# EAGLE design princessPhone (EAGLE 7.3.0)

## Sheet 1 of 4
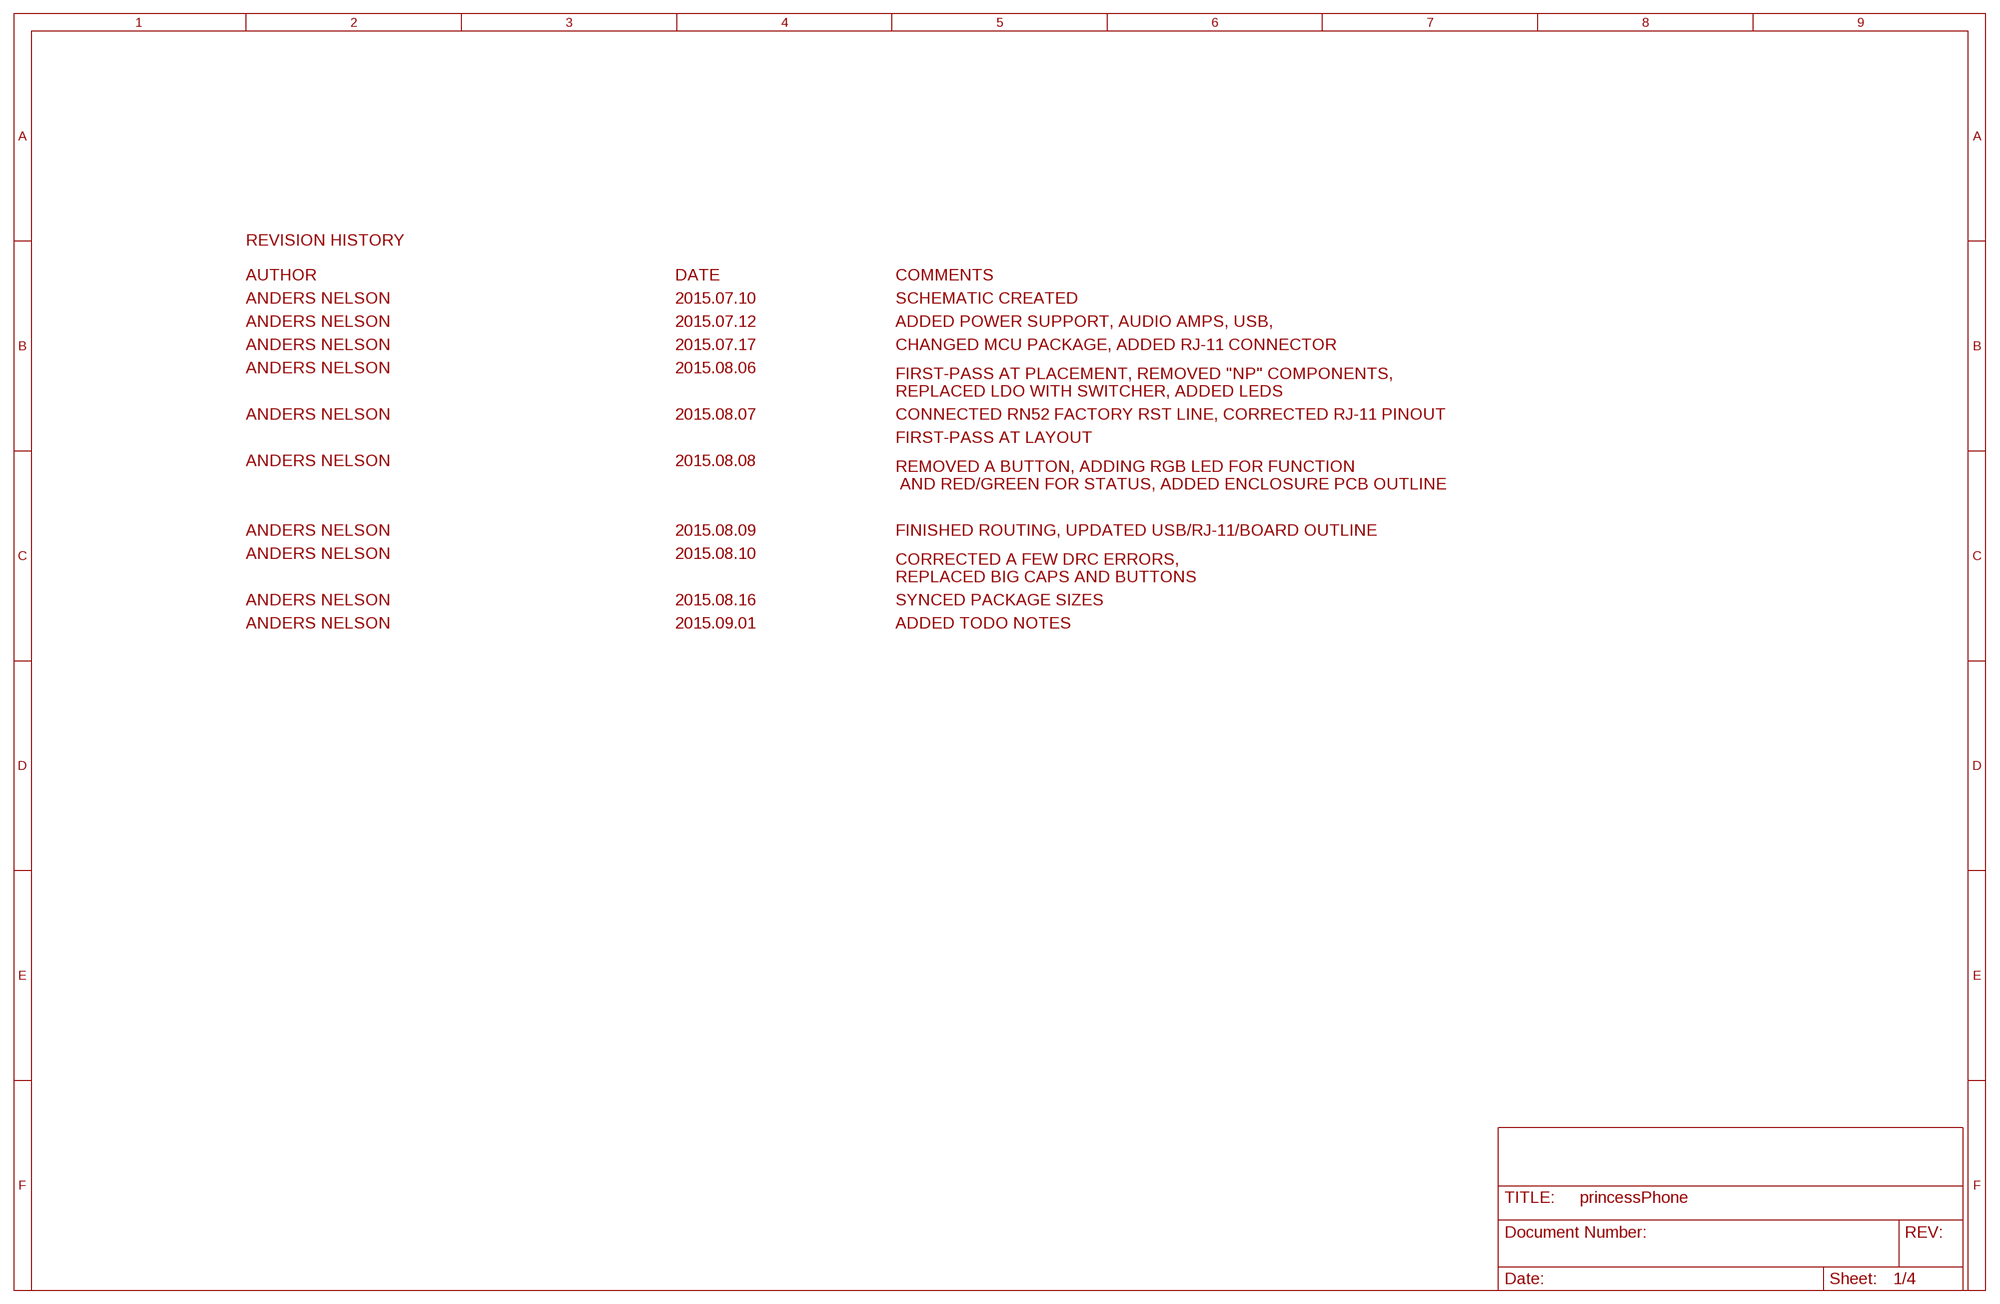
[diagram p0: schematic, sheet 1]

### Notes on the sheet
- REVISION HISTORY
- AUTHOR | DATE | COMMENTS
- ANDERS NELSON | 2015.07.10 | SCHEMATIC CREATED
- ANDERS NELSON | 2015.07.12 | ADDED POWER SUPPORT, AUDIO AMPS, USB,
- ANDERS NELSON | 2015.07.17 | CHANGED MCU PACKAGE, ADDED RJ-11 CONNECTOR
- ANDERS NELSON | 2015.08.06
- FIRST-PASS AT PLACEMENT, REMOVED "NP" COMPONENTS,
  REPLACED LDO WITH SWITCHER, ADDED LEDS
- ANDERS NELSON | 2015.08.07 | CONNECTED RN52 FACTORY RST LINE, CORRECTED RJ-11 PINOUT
- FIRST-PASS AT LAYOUT
- ANDERS NELSON | 2015.08.08
- REMOVED A BUTTON, ADDING RGB LED FOR FUNCTION
   AND RED/GREEN FOR STATUS, ADDED ENCLOSURE PCB OUTLINE
- ANDERS NELSON | 2015.08.09 | FINISHED ROUTING, UPDATED USB/RJ-11/BOARD OUTLINE
- ANDERS NELSON | 2015.08.10
- CORRECTED A FEW DRC ERRORS,
  REPLACED BIG CAPS AND BUTTONS
- ANDERS NELSON | 2015.08.16 | SYNCED PACKAGE SIZES
- ANDERS NELSON | 2015.09.01 | ADDED TODO NOTES

## Sheet 2 of 4
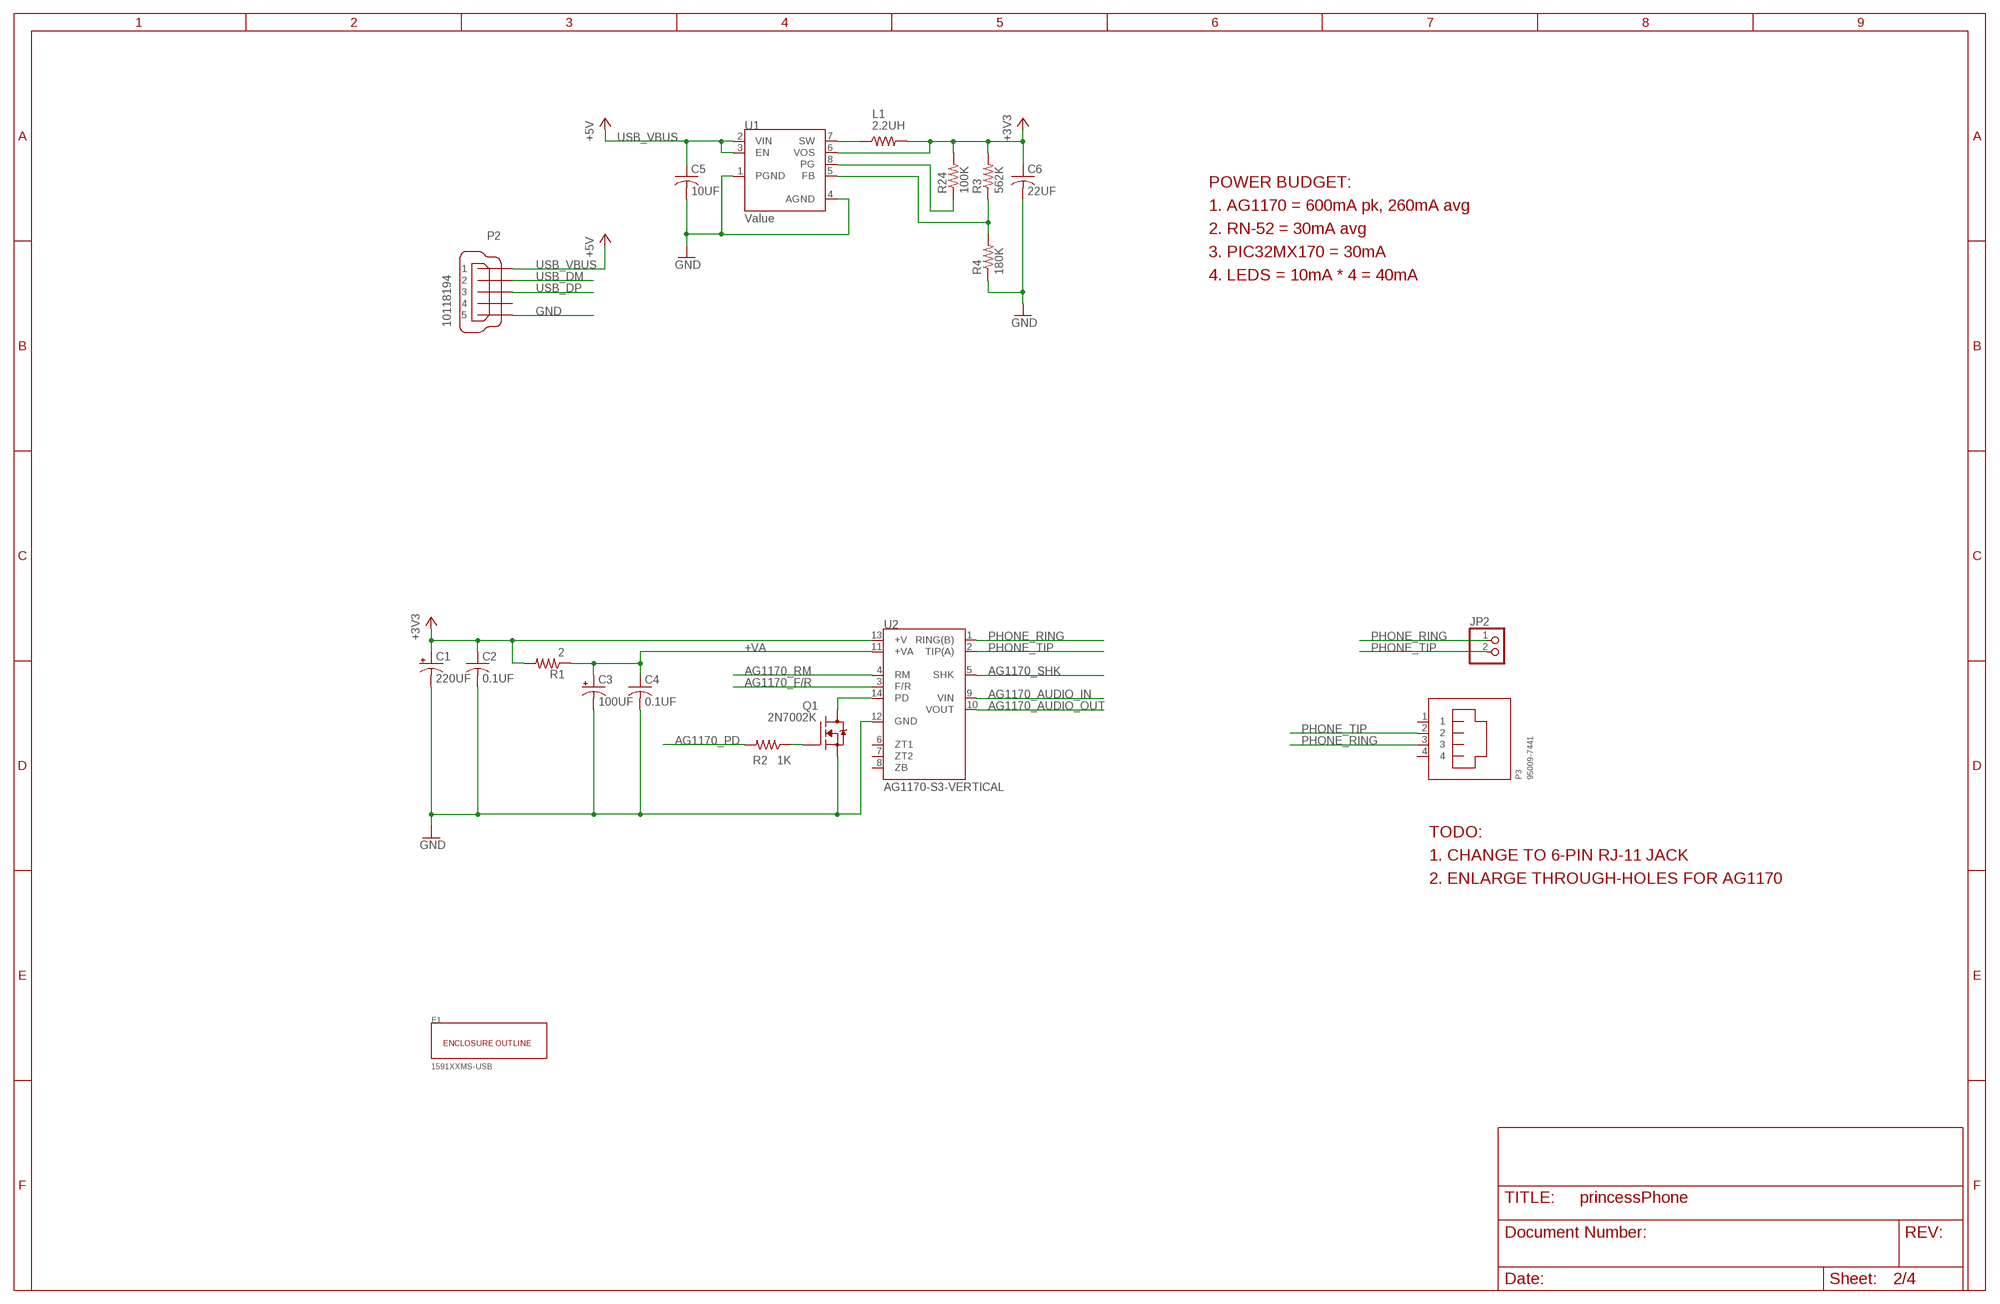
[diagram p1: schematic, sheet 2]

### Parts
C1  220UF  CPOL-USE2.5-7  [E2,5-7]
C2  0.1UF  C-USC0603  [C0603]
C3  100UF  CPOL-USE2.5-7  [E2,5-7]
C4  0.1UF  C-USC0603  [C0603]
C5  10UF  C-USC0603  [C0603]
C6  22UF  C-USC1206  [C1206]
E1  1591XXMS-USB  [1591XXMSBK-USB]
JP2  PINHD-1X2  [1X02]
L1  2.2UH  R-US_R0805  [R0805]
P2  10118194  [10118194]
P3  95009-7441  [95009-7441]
Q1  2N7002K  [SOT23]
R1  2  R-US_R0603  [R0603]
R2  1K  R-US_R0603  [R0603]
R3  562K  R-US_R0603  [R0603]
R4  180K  R-US_R0603  [R0603]
R24  100K  R-US_R0603  [R0603]
U1  Value  TPS62160DGKR  [DGK0008A_N]
U2  AG1170-S3-VERTICAL  [AG1170X-S]

### Nets
+3V3: C1.+ C2.1 C6.1 L1.2 R1.2 R3.2 R24.2 U1.6(VOS) U2.13(+V) ; also sheet 3,4
+VA: C3.+ C4.1 R1.1 U2.11(+VA)
AG1170_AUDIO_IN: U2.9(VIN) ; also sheet 4
AG1170_AUDIO_OUT: U2.10(VOUT) ; also sheet 4
AG1170_F/R: U2.3(F/R) ; also sheet 3
AG1170_PD: R2.2 ; also sheet 3
AG1170_RM: U2.4(RM) ; also sheet 3
AG1170_SHK: U2.5(SHK) ; also sheet 3
GND: C1.- C2.2 C3.- C4.2 C5.2 C6.2 P2.5 Q1.2(S) R4.1 U1.1(PGND) U1.4(AGND) U2.12(GND) ; also sheet 3,4
N$2: Q1.1(G) R2.1
N$3: Q1.3(D) U2.14(PD)
N$5: L1.1 U1.7(SW)
N$6: R24.1 U1.8(PG)
N$8: R3.1 R4.2 U1.5(FB)
PHONE_RING: JP2.1 P3.3 U2.1(RING(B))
PHONE_TIP: JP2.2 P3.2 U2.2(TIP(A))
USB_DM: P2.2 ; also sheet 4
USB_DP: P2.3 ; also sheet 4
USB_VBUS: C5.1 P2.1 U1.2(VIN) U1.3(EN) ; supply symbol labelled +5V ; also sheet 4
Unconnected: P2.4 P3.1 P3.4 U2.6(ZT1) U2.7(ZT2) U2.8(ZB)

### Notes on the sheet
- POWER BUDGET:
- 1. AG1170 = 600mA pk, 260mA avg
- 2. RN-52 = 30mA avg
- 3. PIC32MX170 = 30mA
- 4. LEDS = 10mA * 4 = 40mA
- TODO:
- 1. CHANGE TO 6-PIN RJ-11 JACK
- 2. ENLARGE THROUGH-HOLES FOR AG1170

## Sheet 3 of 4
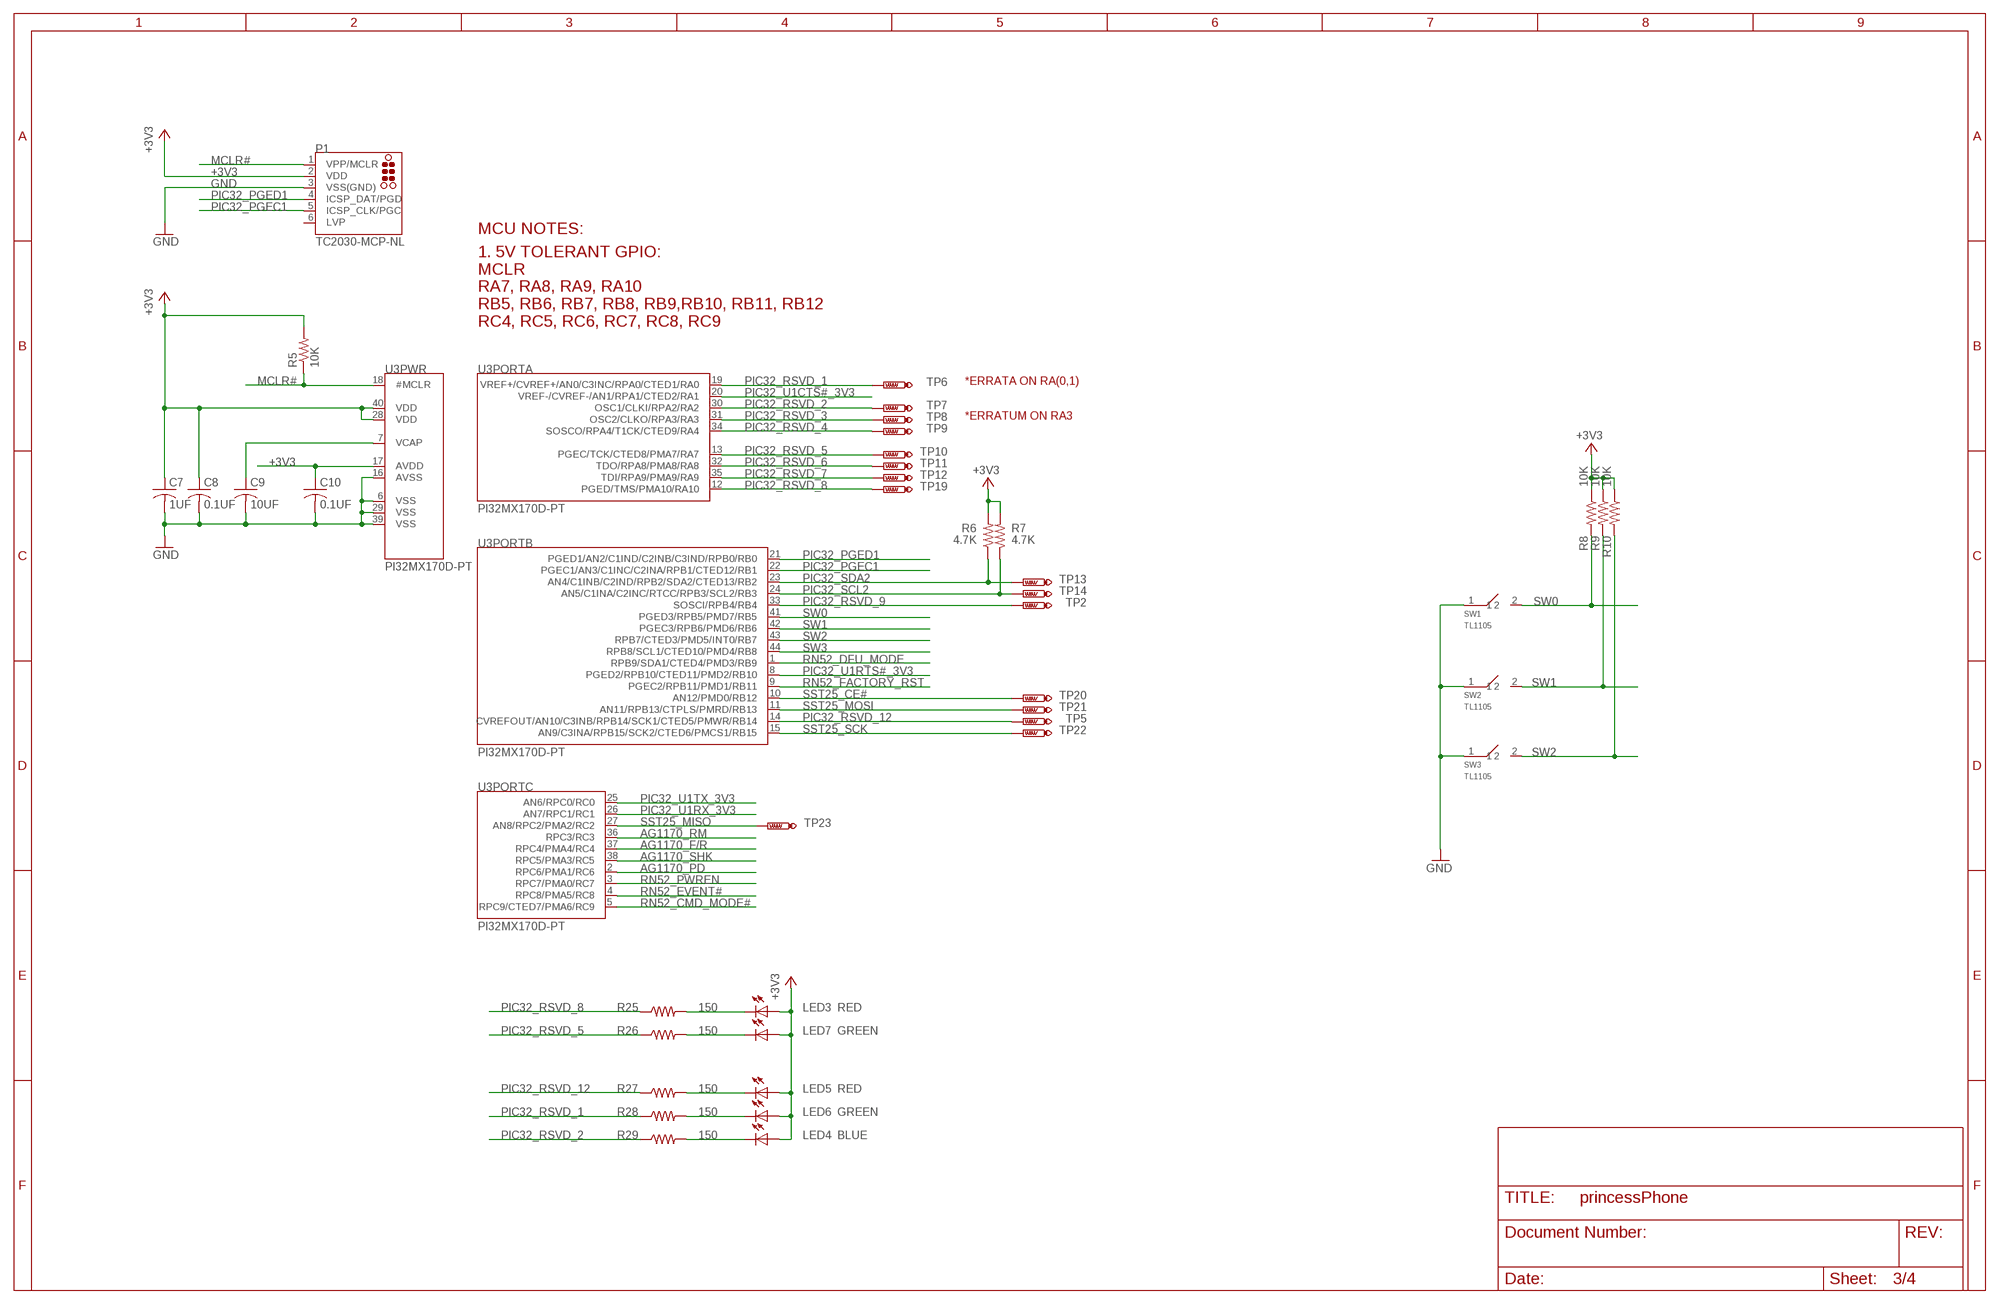
[diagram p2: schematic, sheet 3]

### Parts
C7  1UF  C-USC0603  [C0603]
C8  0.1UF  C-USC0603  [C0603]
C9  10UF  C-USC0603  [C0603]
C10  0.1UF  C-USC0603  [C0603]
LED3  RED  LEDCHIPLED_0603  [CHIPLED_0603]
LED4  BLUE  LEDCHIPLED_0603  [CHIPLED_0603]
LED5  RED  LEDCHIPLED_0603  [CHIPLED_0603]
LED6  GREEN  LEDCHIPLED_0603  [CHIPLED_0603]
LED7  GREEN  LEDCHIPLED_0603  [CHIPLED_0603]
P1  TC2030-MCP-NL  [TC2030-MCP-NL]
R5  10K  R-US_R0603  [R0603]
R6  4.7K  R-US_R0603  [R0603]
R7  4.7K  R-US_R0603  [R0603]
R8  10K  R-US_R0603  [R0603]
R9  10K  R-US_R0603  [R0603]
R10  10K  R-US_R0603  [R0603]
R25  150  R-US_R0603  [R0603]
R26  150  R-US_R0603  [R0603]
R27  150  R-US_R0603  [R0603]
R28  150  R-US_R0603  [R0603]
R29  150  R-US_R0603  [R0603]
SW1  TL1105  [TL1105_RA]
SW2  TL1105  [TL1105_RA]
SW3  TL1105  [TL1105_RA]
TP2  PTR1B1,27  [B1,27]
TP5  PTR1B1,27  [B1,27]
TP6  PTR1B1,27  [B1,27]
TP7  PTR1B1,27  [B1,27]
TP8  PTR1B1,27  [B1,27]
TP9  PTR1B1,27  [B1,27]
TP10  PTR1B1,27  [B1,27]
TP11  PTR1B1,27  [B1,27]
TP12  PTR1B1,27  [B1,27]
TP13  PTR1B1,27  [B1,27]
TP14  PTR1B1,27  [B1,27]
TP19  PTR1B1,27  [B1,27]
TP20  PTR1B1,27  [B1,27]
TP21  PTR1B1,27  [B1,27]
TP22  PTR1B1,27  [B1,27]
TP23  PTR1B1,27  [B1,27]
U3  PI32MX170D-PT  [TQFP44]

### Nets
+3V3: C7.1 C8.1 C10.1 LED3.A LED4.A LED5.A LED6.A LED7.A P1.2(VDD) R5.2 R6.2 R7.2 R8.1 R9.1 R10.1 U3.17(PWR:AVDD) U3.28(PWR:VDD) U3.40(PWR:VDD) ; also sheet 2,4
AG1170_F/R: U3.37(PORTC:RPC4/PMA4/RC4) ; also sheet 2
AG1170_PD: U3.2(PORTC:RPC6/PMA1/RC6) ; also sheet 2
AG1170_RM: U3.36(PORTC:RPC3/RC3) ; also sheet 2
AG1170_SHK: U3.38(PORTC:RPC5/PMA3/RC5) ; also sheet 2
GND: C7.2 C8.2 C9.2 C10.2 P1.3(VSS(GND)) SW1.1 SW2.1 SW3.1 U3.6(PWR:VSS) U3.16(PWR:AVSS) U3.29(PWR:VSS) U3.39(PWR:VSS) ; also sheet 2,4
MCLR#: P1.1(VPP/MCLR) R5.1 U3.18(PWR:#MCLR)
N$1: LED5.C R27.2
N$4: C9.1 U3.7(PWR:VCAP)
N$7: LED3.C R25.2
N$12: LED7.C R26.2
N$13: LED6.C R28.2
N$14: LED4.C R29.2
PIC32_PGEC1: P1.5(ICSP_CLK/PGC) U3.22(PORTB:PGEC1/AN3/C1INC/C2INA/RPB1/CTED12/RB1)
PIC32_PGED1: P1.4(ICSP_DAT/PGD) U3.21(PORTB:PGED1/AN2/C1IND/C2INB/C3IND/RPB0/RB0)
PIC32_RSVD_1: R28.1 TP6.TP U3.19(PORTA:VREF+/CVREF+/AN0/C3INC/RPA0/CTED1/RA0)
PIC32_RSVD_2: R29.1 TP7.TP U3.30(PORTA:OSC1/CLKI/RPA2/RA2)
PIC32_RSVD_3: TP8.TP U3.31(PORTA:OSC2/CLKO/RPA3/RA3)
PIC32_RSVD_4: TP9.TP U3.34(PORTA:SOSCO/RPA4/T1CK/CTED9/RA4)
PIC32_RSVD_5: R26.1 TP10.TP U3.13(PORTA:PGEC/TCK/CTED8/PMA7/RA7)
PIC32_RSVD_6: TP11.TP U3.32(PORTA:TDO/RPA8/PMA8/RA8)
PIC32_RSVD_7: TP12.TP U3.35(PORTA:TDI/RPA9/PMA9/RA9)
PIC32_RSVD_8: R25.1 TP19.TP U3.12(PORTA:PGED/TMS/PMA10/RA10)
PIC32_RSVD_9: TP2.TP U3.33(PORTB:SOSCI/RPB4/RB4)
PIC32_RSVD_12: R27.1 TP5.TP U3.14(PORTB:CVREFOUT/AN10/C3INB/RPB14/SCK1/CTED5/PMWR/RB14)
PIC32_SCL2: R7.1 TP14.TP U3.24(PORTB:AN5/C1INA/C2INC/RTCC/RPB3/SCL2/RB3)
PIC32_SDA2: R6.1 TP13.TP U3.23(PORTB:AN4/C1INB/C2IND/RPB2/SDA2/CTED13/RB2)
PIC32_U1CTS#_3V3: U3.20(PORTA:VREF-/CVREF-/AN1/RPA1/CTED2/RA1) ; also sheet 4
PIC32_U1RTS#_3V3: U3.8(PORTB:PGED2/RPB10/CTED11/PMD2/RB10) ; also sheet 4
PIC32_U1RX_3V3: U3.26(PORTC:AN7/RPC1/RC1) ; also sheet 4
PIC32_U1TX_3V3: U3.25(PORTC:AN6/RPC0/RC0) ; also sheet 4
RN52_CMD_MODE#: U3.5(PORTC:RPC9/CTED7/PMA6/RC9) ; also sheet 4
RN52_DFU_MODE: U3.1(PORTB:RPB9/SDA1/CTED4/PMD3/RB9) ; also sheet 4
RN52_EVENT#: U3.4(PORTC:RPC8/PMA5/RC8) ; also sheet 4
RN52_FACTORY_RST: U3.9(PORTB:PGEC2/RPB11/PMD1/RB11) ; also sheet 4
RN52_PWREN: U3.3(PORTC:RPC7/PMA0/RC7) ; also sheet 4
SST25_CE#: TP20.TP U3.10(PORTB:AN12/PMD0/RB12)
SST25_MISO: TP23.TP U3.27(PORTC:AN8/RPC2/PMA2/RC2)
SST25_MOSI: TP21.TP U3.11(PORTB:AN11/RPB13/CTPLS/PMRD/RB13)
SST25_SCK: TP22.TP U3.15(PORTB:AN9/C3INA/RPB15/SCK2/CTED6/PMCS1/RB15)
SW0: R8.2 SW1.2 U3.41(PORTB:PGED3/RPB5/PMD7/RB5)
SW1: R9.2 SW2.2 U3.42(PORTB:PGEC3/RPB6/PMD6/RB6)
SW2: R10.2 SW3.2 U3.43(PORTB:RPB7/CTED3/PMD5/INT0/RB7)
SW3: U3.44(PORTB:RPB8/SCL1/CTED10/PMD4/RB8)
Unconnected: P1.6(LVP)

### Notes on the sheet
- MCU NOTES:
- 1. 5V TOLERANT GPIO:
  MCLR
  RA7, RA8, RA9, RA10
  RB5, RB6, RB7, RB8, RB9,RB10, RB11, RB12
  RC4, RC5, RC6, RC7, RC8, RC9
- *ERRATA ON RA(0,1)
- *ERRATUM ON RA3

## Sheet 4 of 4
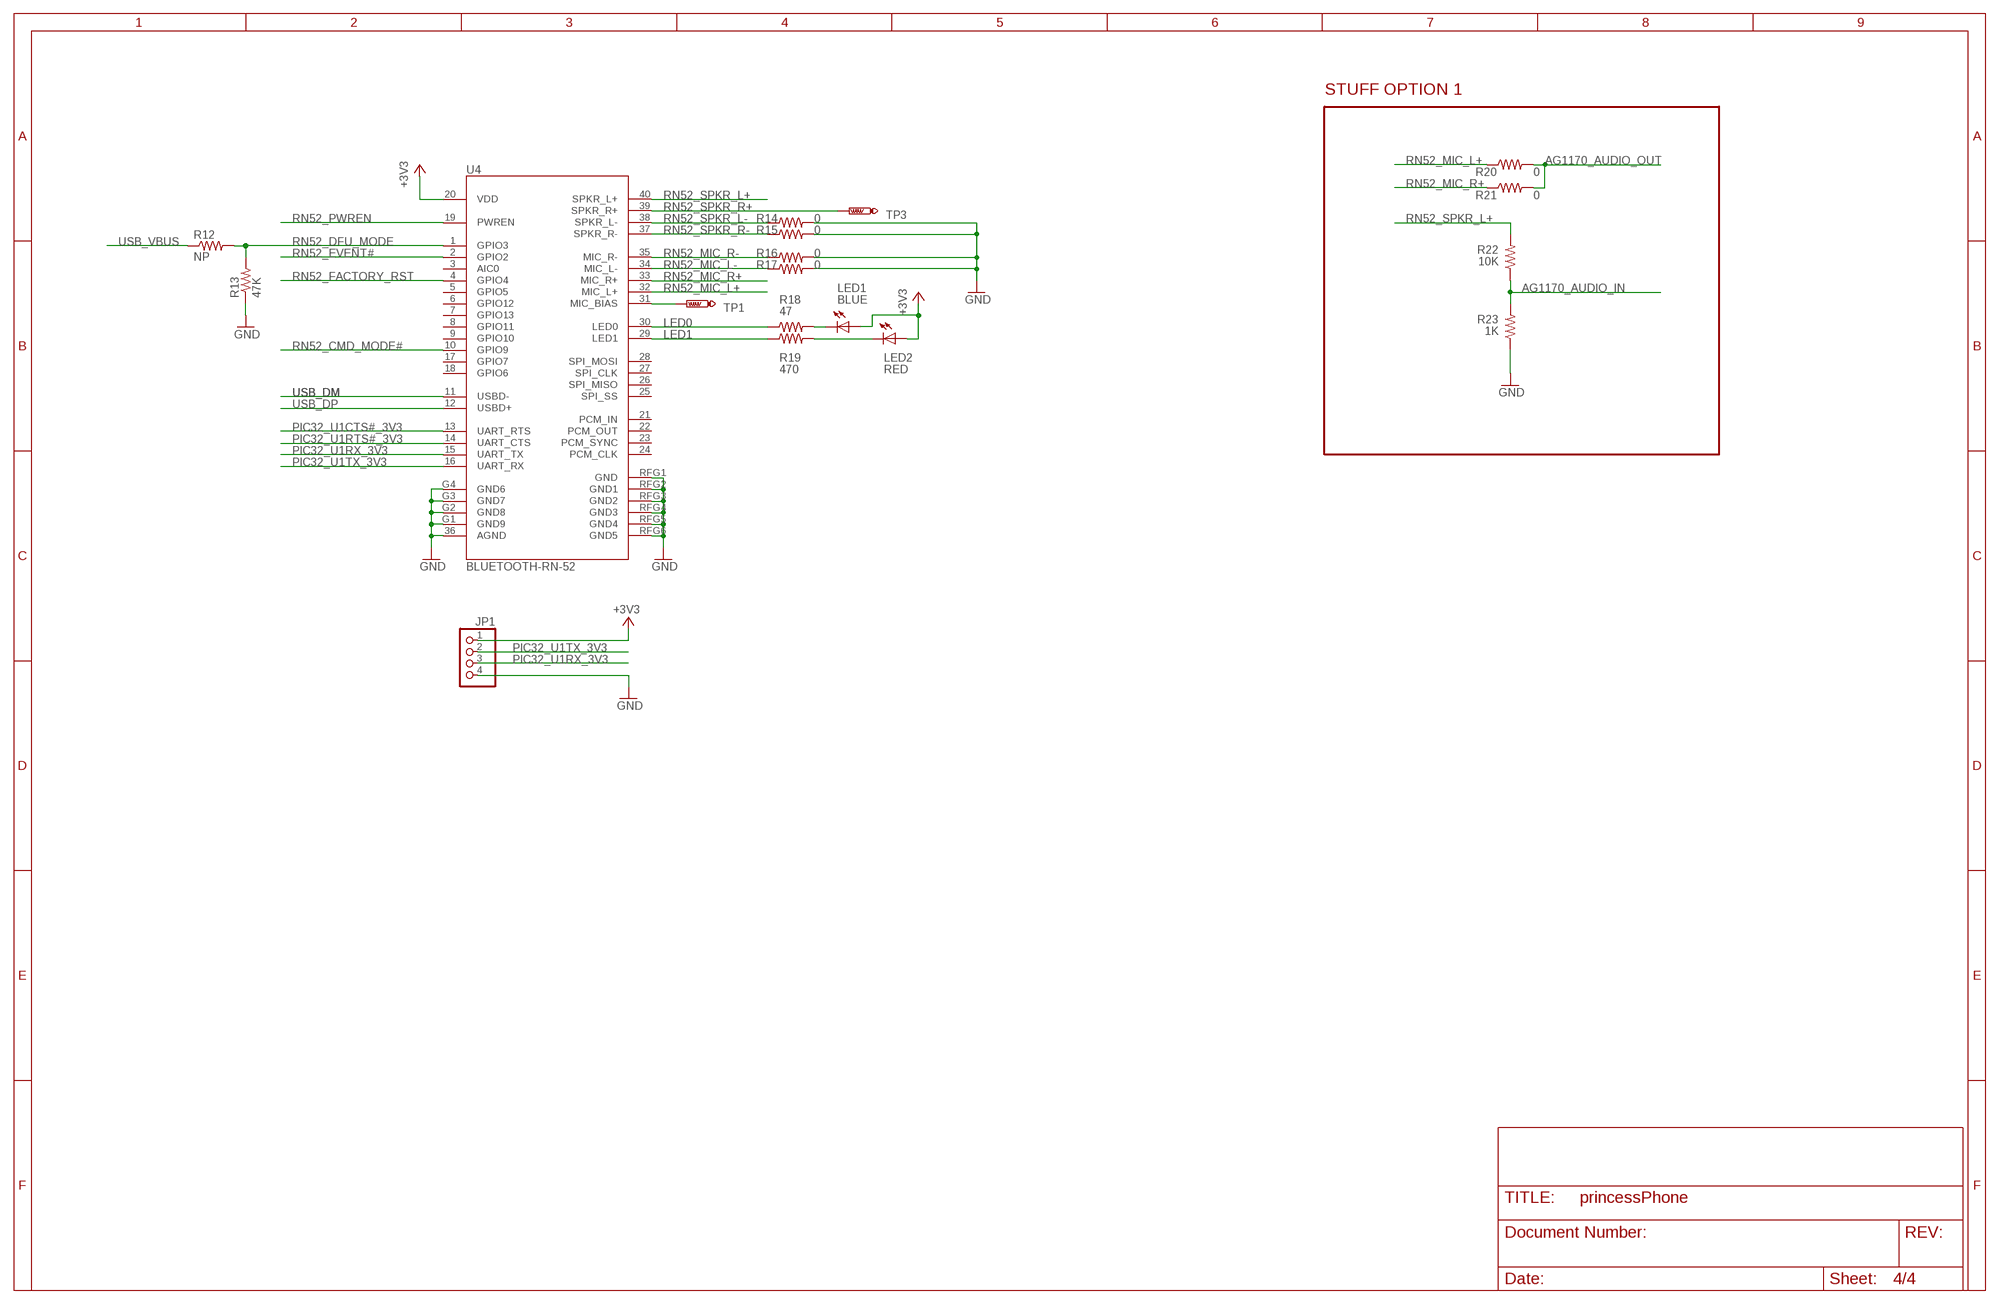
[diagram p3: schematic, sheet 4]

### Parts
JP1  PINHD-1X4  [1X04]
LED1  BLUE  LEDCHIPLED_0603  [CHIPLED_0603]
LED2  RED  LEDCHIPLED_0603  [CHIPLED_0603]
R12  NP  R-US_R0603  [R0603]
R13  47K  R-US_R0603  [R0603]
R14  0  R-US_R0603  [R0603]
R15  0  R-US_R0603  [R0603]
R16  0  R-US_R0603  [R0603]
R17  0  R-US_R0603  [R0603]
R18  47  R-US_R0603  [R0603]
R19  470  R-US_R0603  [R0603]
R20  0  R-US_R0603  [R0603]
R21  0  R-US_R0603  [R0603]
R22  10K  R-US_R0603  [R0603]
R23  1K  R-US_R0603  [R0603]
TP1  PTR1B1,27  [B1,27]
TP3  PTR1B1,27  [B1,27]
U4  BLUETOOTH-RN-52  [RN-52]

### Nets
+3V3: JP1.1 LED1.A LED2.A U4.20(VDD) ; also sheet 2,3
AG1170_AUDIO_IN: R22.1 R23.2 ; also sheet 2
AG1170_AUDIO_OUT: R20.2 R21.2 ; also sheet 2
GND: JP1.4 R13.1 R14.2 R15.2 R16.2 R17.2 R23.1 U4.36(AGND) U4.G1(GND9) U4.G2(GND8) U4.G3(GND7) U4.G4(GND6) U4.RFG1(GND) U4.RFG2(GND1) U4.RFG3(GND2) U4.RFG4(GND3) U4.RFG5(GND4) U4.RFG6(GND5) ; also sheet 2,3
LED0: R18.1 U4.30(LED0)
LED1: R19.1 U4.29(LED1)
N$9: LED1.C R18.2
N$10: LED2.C R19.2
N$11: TP1.TP U4.31(MIC_BIAS)
PIC32_U1CTS#_3V3: U4.13(UART_RTS) ; also sheet 3
PIC32_U1RTS#_3V3: U4.14(UART_CTS) ; also sheet 3
PIC32_U1RX_3V3: JP1.3 U4.15(UART_TX) ; also sheet 3
PIC32_U1TX_3V3: JP1.2 U4.16(UART_RX) ; also sheet 3
RN52_CMD_MODE#: U4.10(GPIO9) ; also sheet 3
RN52_DFU_MODE: R12.2 R13.2 U4.1(GPIO3) ; also sheet 3
RN52_EVENT#: U4.2(GPIO2) ; also sheet 3
RN52_FACTORY_RST: U4.4(GPIO4) ; also sheet 3
RN52_MIC_L+: R20.1 U4.32(MIC_L+)
RN52_MIC_L-: R17.1 U4.34(MIC_L-)
RN52_MIC_R+: R21.1 U4.33(MIC_R+)
RN52_MIC_R-: R16.1 U4.35(MIC_R-)
RN52_PWREN: U4.19(PWREN) ; also sheet 3
RN52_SPKR_L+: R22.2 U4.40(SPKR_L+)
RN52_SPKR_L-: R14.1 U4.38(SPKR_L-)
RN52_SPKR_R+: TP3.TP U4.39(SPKR_R+)
RN52_SPKR_R-: R15.1 U4.37(SPKR_R-)
USB_DM: U4.11(USBD-) ; also sheet 2
USB_DP: U4.12(USBD+) ; also sheet 2
USB_VBUS: R12.1 ; also sheet 2
Unconnected: U4.3(AIC0) U4.5(GPIO5) U4.6(GPIO12) U4.7(GPIO13) U4.8(GPIO11) U4.9(GPIO10) U4.17(GPIO7) U4.18(GPIO6) U4.21(PCM_IN) U4.22(PCM_OUT) U4.23(PCM_SYNC) U4.24(PCM_CLK) U4.25(SPI_SS) U4.26(SPI_MISO) U4.27(SPI_CLK) U4.28(SPI_MOSI)

### Notes on the sheet
- STUFF OPTION 1

## Library data of the parts
C1 C3 = rcl:CPOL-US: POLARIZED CAPACITOR, American symbol
C2 C4-C10 = rcl:C-US: CAPACITOR, American symbol
E1 = princessPhone:1591XXMS
JP1 = pinhead:PINHD-1X4: PIN HEADER
JP2 = pinhead:PINHD-1X2: PIN HEADER
L1 R1-R10 R12-R29 = rcl:R-US_: RESISTOR, American symbol
LED1-LED7 = led:LED: LED OSRAM: - CHIPLED LG R971, LG N971, LY N971, LG Q971, LY Q971, LO R971, LY R971 LH N974, LH R974 LS Q976, LO Q976, LY Q976 LO Q996 - Hyper CHIPLED LW Q18S LB Q993, LB Q99A, LB R99A - SideLED LS A670, LO A670, LY A670, LG A670, LP A670 LB A673, LV A673, LT A673, LW A673 LH A674 LY A675 LS A676, LA A676, LO A676, LY A676, LW A676 LS A679, LY A679, LG A679 - Hyper Micro SIDELED® LS Y876, LA Y876, LO Y876, LY Y876 LT Y87S - SmartLED LW L88C, LW L88S LB L89C, LB L89S, LG L890 LS L89K, LO L89K, LY L89K LS L896, LA L896, LO L896, LY L896 - TOPLED LS T670, LO T670, LY T670, LG T670, LP T670 LSG T670, LSP T670, LSY T670, LOP T670, LYG T670 LG T671, LOG T671, LSG T671 LB T673, LV T673, LT T673, LW T673 LH T674 LS T676, LA T676, LO T676, LY T676, LB T676, LH T676, LSB T676, LW T676 LB T67C, LV T67C, LT T67C, LS T67K, LO T67K, LY T67K, LW E67C LS E67B, LA E67B, LO E67B, LY E67B, LB E67C, LV E67C, LT E67C LW T67C LS T679, LY T679, LG T679 LS T770, LO T770, LY T770, LG T770, LP T770 LB T773, LV T773, LT T773, LW T773 LH T774 LS E675, LA E675, LY E675, LS T675 LS T776, LA T776, LO T776, LY T776, LB T776 LHGB T686 LT T68C, LB T68C - Hyper Mini TOPLED® LB M676 - Mini TOPLED Santana® LG M470 LS M47K, LO M47K, LY M47K Source: http://www.osram.convergy.de LUXEON: - LUMILED® LXK2-PW12-R00, LXK2-PW12-S00, LXK2-PW14-U00, LXK2-PW14-V00 LXK2-PM12-R00, LXK2-PM12-S00, LXK2-PM14-U00 LXK2-PE12-Q00, LXK2-PE12-R00, LXK2-PE12-S00, LXK2-PE14-T00, LXK2-PE14-U00 LXK2-PB12-K00, LXK2-PB12-L00, LXK2-PB12-M00, LXK2-PB14-N00, LXK2-PB14-P00, LXK2-PB14-Q00 LXK2-PR12-L00, LXK2-PR12-M00, LXK2-PR14-Q00, LXK2-PR14-R00 LXK2-PD12-Q00, LXK2-PD12-R00, LXK2-PD12-S00 LXK2-PH12-R00, LXK2-PH12-S00 LXK2-PL12-P00, LXK2-PL12-Q00, LXK2-PL12-R00 Source: www.luxeon.com KINGBRIGHT: KA-3528ASYC Source: www.kingbright.com
P1 = raveGearControl:TC2030: TAG-CONNECT ISP Connector Manufacturer: Tag-Connect <www.tag-connect.com> Cable for easy In-Circuit PCB Programming. Designed for Microchip ICD2, suitable for many others. Two variants - one "with legs" (for hads-free fit on PCB) and another "without legs" for quick programming. PAD Description 1 MCLR/Vpp 2 Vdd 3 GND 4 PGD (ISPDAT) 5 PGC (ISPCLK) 6 nc (used for LVP) ©2009 ROFA.cz
P2 = console_board:10118194
P3 = princessPhone:95009-7441
Q1 = princessPhone:2N7002K
SW1-SW3 = princessPhone:TL1105*
TP1-TP3 TP5-TP14 TP19-TP23 = testpad:PTR1: TEST PIN
U1 = princessPhone:TPS62160DGKR; ALTERNATEPARTNUMBER: TPS62160DGKT; APPLICATION_BUILDNUMBER: *; COMPTYPE: IC; MANUFACTURER: Texas Instruments; MOUNTTYPE: SMT; PACKAGEREFERENCE: DGK0008A; PARTNUMBER: TPS62160DGKR; PIN_COUNT: 8; REFDES: RefDes; ROHS: Y; TYPE: TYPE
U2 = princessPhone:AG1170*
U3 = raveGear5:PI32MX1*D-PT
U4 = SparkFun-RF:BLUETOOTH-RN-52

## Board
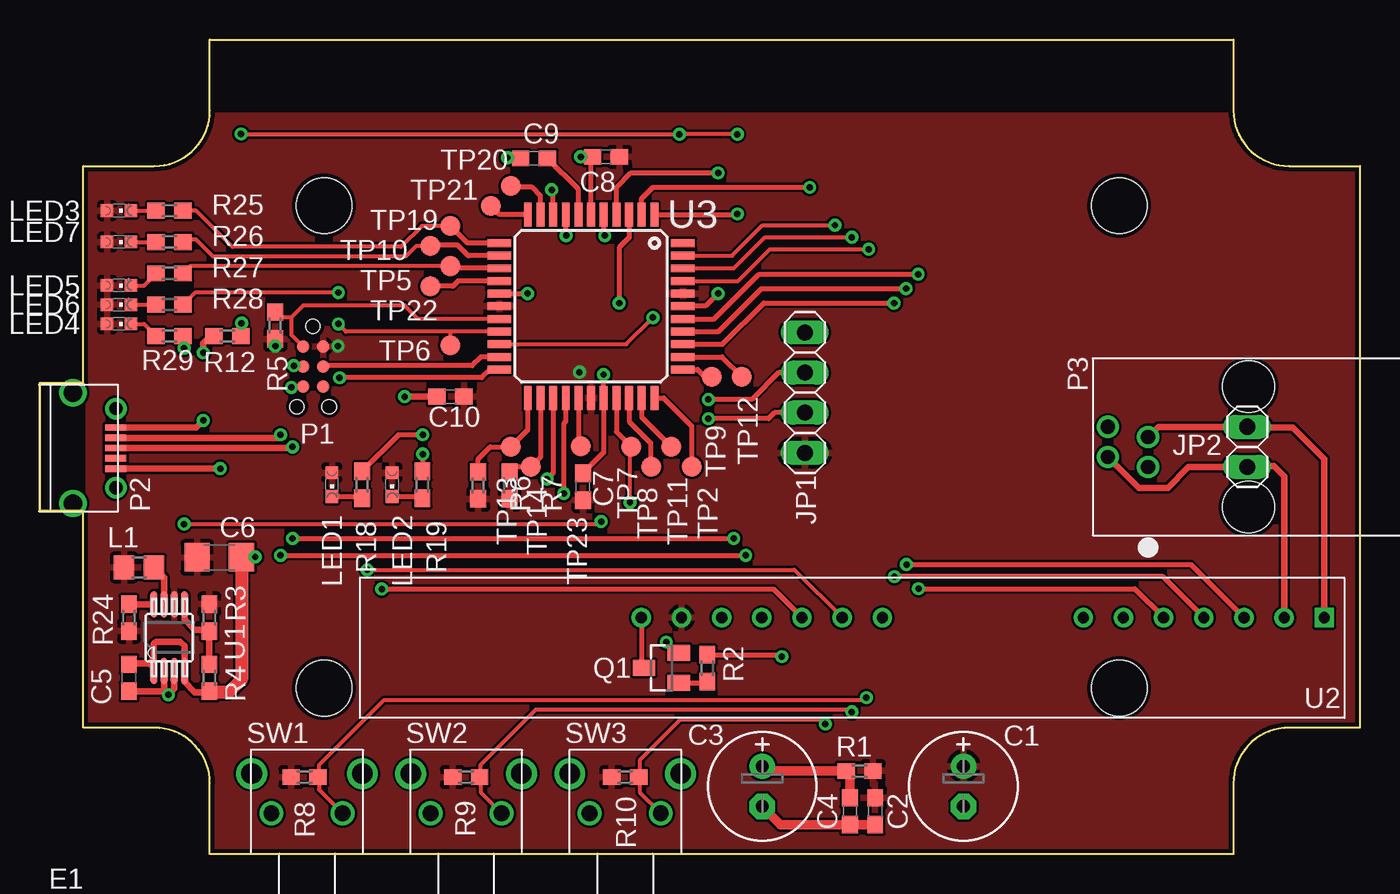
[diagram p4: board, top side]
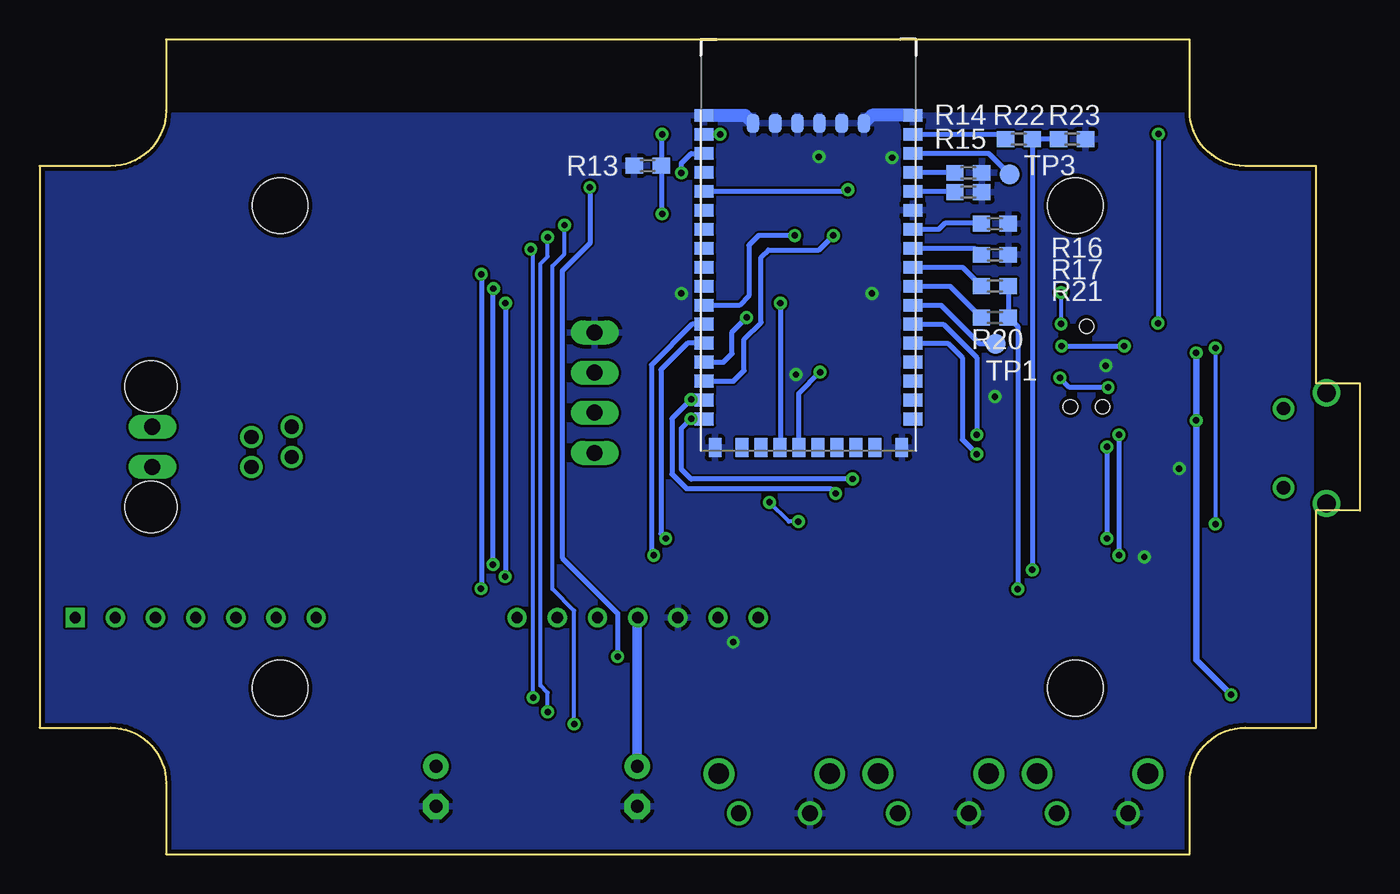
[diagram p5: board, bottom side, seen from below]

Size 83.47 x 51.51 mm. Coordinates in mm from the lower left corner, seen from the top.
Copper layers (1*16): Top 0.035559375mm / dielectric 0.200659375mm / Bottom 0.035559375mm
Design rules "PCBExpress_E2 *": minimum track width 6mil, minimum drill 16mil, track to track 6mil, track to pad 6mil, pad to pad 6mil, via to via 6mil, smd to smd 0mil, copper to edge 10mil, drill to drill 8mil, minimum pad ring 10mil, minimum via ring 8mil, stop-mask expansion 4mil, vias tented up to drill 16mil, thermal gap 10mil

### Footprints (pad centres in the part's own frame; a part is rotated, then mirrored left to right if it is on the bottom)
E2,5-7 = drill 0.813 pad 1.6: + -1.27,0 | drill 0.813 pad 1.6 octagon: - 1.27,0
C0603 = smd 1.1 x 1: 1 -0.85,0; 2 0.85,0
C1206 = smd 1.6 x 1.8: 1 -1.4,0; 2 1.4,0
1591XXMSBK-USB = hole 3.51: 25.135,15.255; -25.135,15.255; -25.135,-15.255; 25.135,-15.255
1X04 = drill 1.016 long: 1 -3.81,0; 2 -1.27,0; 3 1.27,0; 4 3.81,0
1X02 = drill 1.016 long: 1 -1.27,0; 2 1.27,0
R0805 = smd 1.3 x 1.5: 1 -0.95,0; 2 0.95,0
CHIPLED_0603 = smd 0.8 x 0.8: A 0,-0.75; C 0,0.75
TC2030-MCP-NL = smd 0.787 x 0.787: 1 1.27,-0.635; 2 1.27,0.635; 3 2.54,-0.635; 4 2.54,0.635; 5 3.81,-0.635; 6 3.81,0.635 | hole 0.889: 0,0; 5.08,-1.016; 5.08,1.016
10118194 = smd 0.4 x 1.35: 1 -1.3,0; 2 -0.65,0; 3 0,0; 4 0.65,0; 5 1.3,0 | drill 0.85: P$1 -2.5,0; P$2 2.5,0 | drill 1.15: P$3 -3.5,-2.7; P$4 3.5,-2.7
95009-7441 = drill 0.89: 1 1.27,-6.35; 2 0.635,-8.89; 3 -0.635,-6.35; 4 -1.27,-8.89 | hole 3.25: -3.81,0; 3.81,0
SOT23 = smd 1 x 1.4: 1 -0.95,-1.1; 2 0.95,-1.1; 3 0,1.1
R0603 = smd 1.1 x 1: 1 -0.85,0; 2 0.85,0
TL1105_RA = drill 1: 1 -2.25,0; 2 2.25,0 | drill 1.3: P$1 -3.5,2.5; P$2 3.5,2.5
B1,27 = smd 1.27 x 1.27: TP 0,0
DGK0008A_N = smd 1.702 x 0.457: 1 -2.1,0.975; 2 -2.1,0.325; 3 -2.1,-0.325; 4 -2.1,-0.975; 5 2.1,-0.975; 6 2.1,-0.325; 7 2.1,0.325; 8 2.1,0.975
AG1170X-S = drill 0.711 square: 1 21.59,0 | drill 0.711: 2 19.05,0; 3 16.51,0; 4 13.97,0; 5 11.43,0; 6 8.89,0; 7 6.35,0; 8 -6.35,0; 9 -8.89,0; 10 -11.43,0; 11 -13.97,0; 12 -16.51,0; 13 -19.05,0; 14 -21.59,0
TQFP44 = smd 1.5 x 0.5: 1 -5.8,4; 2 -5.8,3.2; 3 -5.8,2.4; 4 -5.8,1.6; 5 -5.8,0.8; 6 -5.8,0; 7 -5.8,-0.8; 8 -5.8,-1.6; 9 -5.8,-2.4; 10 -5.8,-3.2; 11 -5.8,-4; 23 5.8,-4; 24 5.8,-3.2; 25 5.8,-2.4; 26 5.8,-1.6; 27 5.8,-0.8; 28 5.8,0; 29 5.8,0.8; 30 5.8,1.6; 31 5.8,2.4; 32 5.8,3.2; 33 5.8,4 | smd 0.5 x 1.5: 12 -4,-5.8; 13 -3.2,-5.8; 14 -2.4,-5.8; 15 -1.6,-5.8; 16 -0.8,-5.8; 17 0,-5.8; 18 0.8,-5.8; 19 1.6,-5.8; 20 2.4,-5.8; 21 3.2,-5.8; 22 4,-5.8; 34 4,5.8; 35 3.2,5.8; 36 2.4,5.8; 37 1.6,5.8; 38 0.8,5.8; 39 0,5.8; 40 -0.8,5.8; 41 -1.6,5.8; 42 -2.4,5.8; 43 -3.2,5.8; 44 -4,5.8
RN-52 = smd 1.2 x 0.8: 1 -6.6,8.33; 2 -6.6,7.13; 3 -6.6,5.93; 4 -6.6,4.73; 5 -6.6,3.53; 6 -6.6,2.33; 7 -6.6,1.13; 8 -6.6,-0.07; 9 -6.6,-1.27; 10 -6.6,-2.47; 11 -6.6,-3.67; 12 -6.6,-4.87; 13 -6.6,-6.07; 14 -6.6,-7.27; 15 -6.6,-8.47; 16 -6.6,-9.67; 25 6.6,-9.67; 26 6.6,-8.47; 27 6.6,-7.27; 28 6.6,-6.07; 29 6.6,-4.87; 30 6.6,-3.67; 31 6.6,-2.47; 32 6.6,-1.27; 33 6.6,-0.07; 34 6.6,1.13; 35 6.6,2.33; 36 6.6,3.53; 37 6.6,4.73; 38 6.6,5.93; 39 6.6,7.13; 40 6.6,8.33; G1 -6.6,9.53; G4 6.6,9.53 | smd 0.8 x 1.2: 17 -4.2,-11.47; 18 -3,-11.47; 19 -1.8,-11.47; 20 -0.6,-11.47; 21 0.6,-11.47; 22 1.8,-11.47; 23 3,-11.47; 24 4.2,-11.47; G2 -5.9,-11.47; G3 5.9,-11.46; RFG1 -3.5,9.03; RFG2 -2.1,9.03; RFG3 -0.7,9.03; RFG4 0.7,9.03; RFG5 2.1,9.03; RFG6 3.5,9.03

### Placement (x,y rotation side)
C1  58.41,4.29 270 top
C2  52.82,2.72 270 top
C3  45.69,4.29 270 top
C4  51.22,2.72 270 top
C5  5.65,11.15 90 top
C6  11.37,18.77 0 top
C7  34.36,23.24 90 top
C8  35.8,44.09 180 top
C9  31.26,43.99 180 top
C10  25.97,28.93 180 top
E1  43.12,25.75 0 top
JP1  48.38,29.18 90 top
JP2  76.34,25.75 270 top
L1  6.29,18.13 180 top
LED1  18.48,23.37 180 top
LED2  22.29,23.37 180 top
LED3  5.02,40.69 270 top
LED4  5.02,33.53 270 top
LED5  5.02,35.97 270 top
LED6  5.02,34.75 270 top
LED7  5.02,38.71 270 top
P1  17.29,33.38 270 top
P2  4.82,25.68 270 top
P3  76.43,25.75 270 top
Q1  39.31,11.78 90 top
R1  51.83,5.26 0 top
R2  42.21,11.76 90 top
R3  10.73,14.96 90 top
R4  10.73,11.15 90 top
R5  14.9,33.43 270 top
R6  27.73,23.32 270 top
R7  29.71,23.32 270 top
R8  16.75,4.88 0 top
R9  26.97,4.88 0 top
R10  37.02,4.88 0 top
R12  11.88,32.77 0 top
R13  45.02,43.53 0 bottom
R14  24.76,43.08 0 bottom
R15  24.76,41.86 0 bottom
R16  23.08,39.88 0 bottom
R17  23.08,37.9 0 bottom
R18  20.39,23.37 270 top
R19  24.2,23.37 270 top
R20  23.08,33.93 0 bottom
R21  23.08,35.91 0 bottom
R22  21.56,45.21 180 bottom
R23  18.2,45.21 180 bottom
R24  5.65,14.96 270 top
R25  8.22,40.69 180 top
R26  8.22,38.71 180 top
R27  8.22,36.73 180 top
R28  8.22,34.75 180 top
R29  8.22,32.77 180 top
SW1  16.91,2.59 0 top
SW2  26.97,2.59 0 top
SW3  37.02,2.59 0 top
TP1  23.03,32.28 0 bottom
TP2  41.21,24.48 270 top
TP3  22.14,42.98 0 bottom
TP5  25.97,37.19 270 top
TP6  25.97,32.18 270 top
TP7  37.41,25.75 270 top
TP8  38.67,24.48 270 top
TP9  42.48,30.2 270 top
TP10  24.7,38.45 270 top
TP11  39.95,25.75 270 top
TP12  44.39,30.2 270 top
TP13  29.78,25.75 270 top
TP14  31.05,24.48 270 top
TP19  25.97,39.73 270 top
TP20  29.78,42.27 270 top
TP21  28.51,40.99 270 top
TP22  24.7,35.91 270 top
TP23  34.23,25.78 270 top
U1  8.2,13.69 90 top
U2  59.63,14.96 0 top
U3  34.86,34.64 270 top
U4  34.86,37.19 0 bottom

### Tracks (layer width: path | path; a pad name or v marks a point on that pad's centre or on a via)
+3V3  (via drill 0.41)
  Top 0.406: v14.9,32.13 R5.2 14.9,32.89 15.05,32.89 15.05,32.74
  Bottom 0.305: v18.86,32.13 v14.9,32.13 | U4.20 35.46,29.14 v34.13,30.48
  pour Top: 3.11,46.71 83.12,46.71 83.12,0.36 3.11,0.36
+VA
  Top 0.61: C4.1 51.22,5.02 R1.1 45.99,5.26 C3.+
  Bottom 0.61: U2.11 45.71,14.91 45.71,5.59 C3.+
AG1170_AUDIO_IN  (via drill 0.41)
  Top 0.254: v20.72,17.98 47.72,17.98 U2.9
  Bottom 0.305: R23.2 R22.1 20.7,17.99 v20.72,17.98
AG1170_AUDIO_OUT  (via drill 0.41)
  Top 0.305: v21.63,16.76 46.4,16.76 U2.10
  Bottom 0.305: R21.2 R20.2 22.19,33.93 21.63,33.38 v21.63,16.76
AG1170_F/R  (via drill 0.41)
  Top 0.305: U3.37 42.92,33.05 45.63,35.76 v54.78,35.76 | v54.8,18.31 72.79,18.31 U2.3
  Bottom 0.305: v54.8,18.31 54.8,35.74 v54.78,35.76
AG1170_PD  (via drill 0.41)
  Top 0.305: U3.2 38.06,41.45 38.78,42.16 v48.68,42.16 | R2.2 46.74,12.61 v46.93,12.5
  Bottom 0.305: v48.68,42.16 48.68,38.63 50.43,36.88 50.43,18.74 46.93,15.24 v46.93,12.5
AG1170_RM  (via drill 0.41)
  Top 0.305: U3.36 43.18,32.24 45.79,34.85 v54.02,34.85 | v54.04,17.55 71.01,17.55 U2.4
  Bottom 0.305: v54.02,34.85 54.02,17.58 v54.04,17.55
AG1170_SHK  (via drill 0.41)
  Top 0.305: U3.38 42.65,33.84 45.48,36.68 v55.54,36.68 | v55.57,16.79 69.23,16.79 U2.5
  Bottom 0.305: v55.54,36.68 55.54,16.81 v55.57,16.79
GND  (via drill 0.41)
  Top 0.305: U3.16 30.84,35.45 v30.85,35.46 | C8.2 v34.2,44.09 | 35.12,44.13 C8.2 | U3.39 40.72,34.7 42.13,34.7 v42.89,35.46 | Q1.2 40.29,12.73 v39.61,13.41 | v35.65,30.33 35.66,30.31 U3.29 35.66,25.4 C7.2 | U3.6 34.86,44 C8.2 | C9.2 29.63,43.99 v29.58,44.04
  Top 0.406: U1.1 7.22,11.77 6.92,12.06 | 6.92,12.06 5.69,12.06 C5.2 | 6.92,12.06 7.23,12.37 7.23,13.28 7.38,13.44 8.91,13.44 9.17,13.17 U1.4 9.17,10.89 9.82,10.24 10.67,10.24 R4.1 | P1.3 16.12,30.84 v16.07,30.89 | C6.2 13.76,18.77 v13.63,18.79 | C10.2 v23.08,28.93 | P2.5 v11.42,24.38
  Top 0.61: C2.2 C4.2 46.84,1.87 C3.-
  Top 0.813: C6.2 12.77,11.05 11.95,10.24 10.8,10.24 R4.1
  Bottom 0.813: U4.G4 30.86,46.72 U4.RFG6 | U4.G1 38.86,46.72 U4.RFG1
  pour Bottom: 3.11,46.71 83.12,46.71 83.12,0.36 3.11,0.36
LED0  (via drill 0.41)
  Top 0.305: v24.22,26.52 22.69,26.52 R18.1
  Bottom 0.305: U4.30 26.34,33.52 24.22,31.39 v24.22,26.52
LED1  (via drill 0.41)
  Top 0.305: v24.22,25.3 24.22,24.24 R19.1
  Bottom 0.305: U4.29 26.06,32.31 25.14,31.39 25.14,26.21 v24.22,25.3
MCLR#
  Top 0.254: 15.92,33.93 16.68,34.7 23.08,34.7 23.69,34.09 23.93,33.84 U3.18 | 15.92,33.93 15.92,32.84 P1.1 | 15.92,33.93 15.04,33.93 R5.1
N$1
  Top 0.254: LED5.C 6.61,35.97 R27.2
N$2
  Top 0.305: Q1.1 42.13,10.83 R2.1
N$3
  Top 0.305: U2.14 38.04,11.95 Q1.3
N$4
  Top 0.305: U3.7 34.06,42.03 C9.1
N$5
  Top 0.406: U1.7 7.87,17.5 L1.1
N$6
  Top 0.406: U1.8 5.67,15.79 R24.1
N$7
  Top 0.254: LED3.C R25.2
N$8
  Top 0.406: U1.5 9.17,14.85 9.82,14.2 10.65,14.2 R3.1 R4.2
N$9
  Top 0.305: LED1.C 20.29,22.62 R18.2
N$10
  Top 0.305: LED2.C 24.1,22.62 R19.2
N$11
  Bottom 0.305: U4.31 26.48,34.72 24.04,32.28 TP1.TP
N$12
  Top 0.254: LED7.C R26.2
N$13
  Top 0.254: LED6.C R28.2
N$14
  Top 0.254: LED4.C 6.61,33.53 R29.2
PHONE_RING
  Top 0.406: U2.1 81.22,24.99 79.24,26.97 76.39,26.97 JP2.1 70.71,27.02 P3.3
PHONE_TIP
  Top 0.406: P3.2 69.49,23.16 71.31,23.16 72.63,24.48 JP2.2 76.39,24.54 78.02,24.54 78.68,23.88 U2.2
PIC32_PGEC1  (via drill 0.41)
  Top 0.305: P1.5 15.97,29.56 v15.92,29.51 | U3.22 28.48,30.64 27.96,30.12 v18.96,30.12
  Bottom 0.305: v15.92,29.51 18.35,29.51 v18.96,30.12
PIC32_PGED1
  Top 0.305: U3.21 27.91,31.45 27.35,30.89 17.97,30.89 P1.4
PIC32_RSVD_1  (via drill 0.41)
  Top 0.254: v18.89,35.51 9.83,35.51 R28.1 | U3.19 25.9,33.05 | 25.9,33.05 19.37,33.05 v18.89,33.53 | TP6.TP 25.97,32.97 25.9,33.05
  Bottom 0.254: v18.89,33.53 v18.89,35.51
PIC32_RSVD_2  (via drill 0.41)
  Top 0.254: R29.1 9.07,32.07 v9.13,32 | v37.33,22.25 37.33,25.68 TP7.TP | v9.13,20.88 35.35,20.88 v35.5,21.03
  Top 0.305: U3.30 36.46,26.7 TP7.TP
  Bottom 0.254: v9.13,32 v9.13,20.88 | v35.5,21.03 36.11,21.03 v37.33,22.25
PIC32_RSVD_3
  Top 0.305: U3.31 37.27,27.37 38.62,26.01 38.62,24.54 TP8.TP
PIC32_RSVD_4
  Top 0.305: U3.34 41.61,30.64 41.98,30.28 42.41,30.28 TP9.TP
PIC32_RSVD_5
  Top 0.254: TP10.TP 23.82,38.45 23.16,37.8 10.96,37.8 9.9,38.86 9.22,38.86 R26.1
  Top 0.305: U3.13 27.09,37.84 26.43,38.51 24.76,38.51 TP10.TP
PIC32_RSVD_6
  Top 0.305: U3.32 38.06,27.63 TP11.TP
PIC32_RSVD_7
  Top 0.305: U3.35 43.14,31.45 TP12.TP
PIC32_RSVD_8
  Top 0.254: TP19.TP 24.17,39.73 22.85,38.4 12.18,38.4 9.9,40.69 R25.1
  Top 0.305: U3.12 27.05,38.64 TP19.TP
PIC32_RSVD_9
  Top 0.305: U3.33 39.45,28.84 41.21,27.08 TP2.TP
PIC32_RSVD_12
  Top 0.254: TP5.TP 9.53,37.19 R27.1
  Top 0.305: U3.14 26.11,37.05 TP5.TP
PIC32_SCL2
  Top 0.305: U3.24 31.66,25.09 TP14.TP 30.03,24.48 R7.1
PIC32_SDA2
  Top 0.305: U3.23 30.86,26.84 TP13.TP 28.49,25.75 27.73,24.99 R6.1
PIC32_U1CTS#_3V3  (via drill 0.41)
  Top 0.254: U3.20 37.09,32.24 v38.78,33.93
  Bottom 0.305: U4.13 40.22,31.11 39.69,31.65 39.69,33.02 v38.78,33.93
PIC32_U1RTS#_3V3  (via drill 0.41)
  Top 0.305: v33.29,39.11 33.29,40.42 U3.8
  Bottom 0.305: U4.14 39.59,29.91 38.93,30.58 38.93,32.56 37.86,33.63 37.86,37.74 37.41,38.2 34.2,38.2 v33.29,39.11
PIC32_U1RX_3V3  (via drill 0.41)
  Top 0.305: U3.26 33.27,27.36 33.14,27.23 v33.14,22.81 | JP1.3 46.73,30.45 45.02,28.75 v42.28,28.75
  Bottom 0.305: U4.15 42.17,28.87 v42.28,28.75 43.5,27.53 43.5,24.03 42.59,23.11 33.44,23.11 v33.14,22.81
PIC32_U1TX_3V3  (via drill 0.41)
  Top 0.305: U3.25 32.46,24.12 v32.07,23.72 | JP1.2 46.47,27.91 46.09,27.53 v42.28,27.53
  Bottom 0.305: v32.07,23.72 42.28,23.72 42.89,24.33 42.89,26.92 v42.28,27.53 41.48,27.53 U4.16
RN52_CMD_MODE#  (via drill 0.41)
  Top 0.305: U3.5 35.66,39.18 v35.73,39.11
  Bottom 0.305: v35.73,39.11 38.02,39.11 38.62,38.51 38.62,35.3 39.23,34.7 39.25,34.72 U4.10
RN52_DFU_MODE  (via drill 0.41)
  Top 0.254: v44.11,45.52 v40.45,45.52 40.43,45.54 v12.74,45.54
  Top 0.305: U3.1 44.07,40.45 v44.11,40.49 | v12.77,33.58 12.77,32.8 R12.2
  Bottom 0.305: v40.45,45.52 U4.1 | v44.11,40.49 44.11,43.47 | 44.11,43.47 R13.2 | 44.11,43.47 v44.11,45.52 | v12.74,45.54 12.74,33.6 v12.77,33.58
RN52_EVENT#  (via drill 0.41)
  Top 0.305: U3.4 36.46,42.14 37.41,43.08 v42.89,43.08
  Bottom 0.305: v42.89,43.08 42.89,43.69 42.28,44.3 41.45,44.3 U4.2
RN52_FACTORY_RST  (via drill 0.41)
  Top 0.305: U3.9 32.46,41.92 v32.38,42.01
  Bottom 0.305: U4.4 32.47,41.91 v32.38,42.01
RN52_MIC_L+
  Bottom 0.305: U4.32 25.91,35.91 R20.1
RN52_MIC_L-
  Bottom 0.305: U4.34 24.35,38.31 R17.1
RN52_MIC_R+
  Bottom 0.305: U4.33 25.13,37.11 R21.1
RN52_MIC_R-
  Bottom 0.305: U4.35 26.62,39.52 26.2,39.93 23.98,39.93 R16.1
RN52_PWREN  (via drill 0.41)
  Top 0.305: U3.3 37.27,38.98 36.64,38.35 v36.64,34.85
  Bottom 0.305: v36.64,34.85 36.64,25.74 U4.19
RN52_SPKR_L+
  Bottom 0.305: U4.40 22.71,45.52 R22.2
RN52_SPKR_L-
  Bottom 0.305: U4.38 25.44,43.11 R14.1
RN52_SPKR_R+
  Bottom 0.305: U4.39 23.48,44.31 TP3.TP
RN52_SPKR_R-
  Bottom 0.305: U4.37 25.46,41.91 R15.1
SST25_CE#
  Top 0.305: U3.10 31.66,41.66 31.16,42.16 29.89,42.16 TP20.TP
SST25_MISO
  Top 0.305: U3.27 34.06,26 34.2,25.86 34.2,25.81 TP23.TP
SST25_MOSI
  Top 0.305: U3.11 29.06,40.45 TP21.TP
SST25_SCK
  Top 0.305: U3.15 26.46,36.24 26.13,35.91 TP22.TP
SW0  (via drill 0.41)
  Top 0.254: 17.67,4.89 R8.2 | v52.42,38.25 46.17,38.25 44.16,36.24 U3.41 | 17.67,4.89 17.68,4.89 17.68,5.65 21.78,9.75 52.11,9.75 v52.26,9.9 | 17.67,4.89 17.67,4.08 SW1.2
  Bottom 0.254: v52.26,9.9 52.26,38.25 v52.42,38.25
SW1  (via drill 0.41)
  Top 0.254: U3.42 43.89,37.05 45.86,39.01 v51.35,39.01 | v51.35,8.99 51.2,9.14 31.38,9.14 27.88,5.64 27.88,4.88 R9.2 27.88,4.81 27.88,3.93 SW2.2
  Bottom 0.254: v51.35,8.99 51.35,10.21 51.81,10.67 51.81,37.34 51.35,37.8 v51.35,39.01
SW2  (via drill 0.41)
  Top 0.254: U3.43 43.78,37.84 45.71,39.78 v50.28,39.78 | v49.67,8.23 49.37,8.53 40.53,8.53 37.96,5.97 37.96,4.9 R10.2 37.94,4.86 37.94,3.93 SW3.2
  Bottom 0.254: v49.67,8.23 49.67,15.39 51.04,16.76 51.04,37.19 50.28,37.95 v50.28,39.78
USB_DM  (via drill 0.41)
  Top 0.305: 15.19,26.56 v15.23,26.52 | v15.23,18.9 v44.64,18.9
  Top 0.406: P2.2 15.04,26.33 v15.23,26.52
  Bottom 0.305: U4.11 42.22,33.52 44.8,30.94 44.8,19.05 v44.64,18.9 | v15.23,26.52 v15.23,18.9
USB_DP  (via drill 0.41)
  Top 0.305: v15.99,19.96 v43.88,19.96
  Top 0.406: P2.3 15.92,25.68 v15.99,25.75
  Bottom 0.305: U4.12 42.5,32.31 44.19,30.63 44.19,20.27 v43.88,19.96 | v15.99,25.75 v15.99,19.96
USB_VBUS  (via drill 0.41)
  Top 0.406: U1.3 8.52,10.46 v8.14,10.08 | U1.2 7.87,10.36 v8.14,10.08 | 8.03,10.2 v8.14,10.08 | P2.1 9.89,26.98 v10.35,27.43 | R12.1 10.81,32.77 10.35,32.31 v10.35,31.7 | C5.1 7.93,10.3 v8.14,10.08
  Bottom 0.406: v10.35,31.7 v10.35,27.43 10.35,12.29 v8.14,10.08

### Text on the board
Document: GND | Rev A | RX | TX | RING | 3V3 | TIP